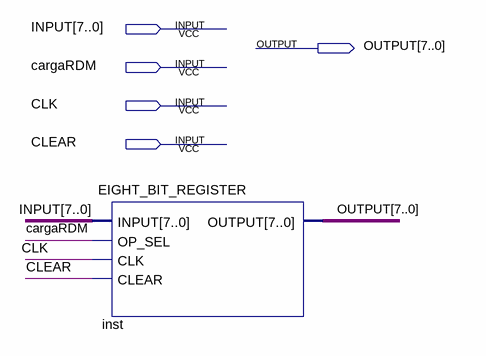
[diagram p0: schematic sheet]
// Quartus schematic RDM.bdf as structural Verilog: 1 symbols, 5 pins
module RDM (
  input  [7:0] INPUT,
  input  cargaRDM,
  input  CLK,
  input  CLEAR,
  output [7:0] OUTPUT
);

  EIGHT_BIT_REGISTER inst (.INPUT(INPUT), .OP_SEL(cargaRDM), .CLK(CLK), .CLEAR(CLEAR), .OUTPUT(OUTPUT));
endmodule
